# Altium project STM32F373BluePill.PrjPcb (part 1 of 4)
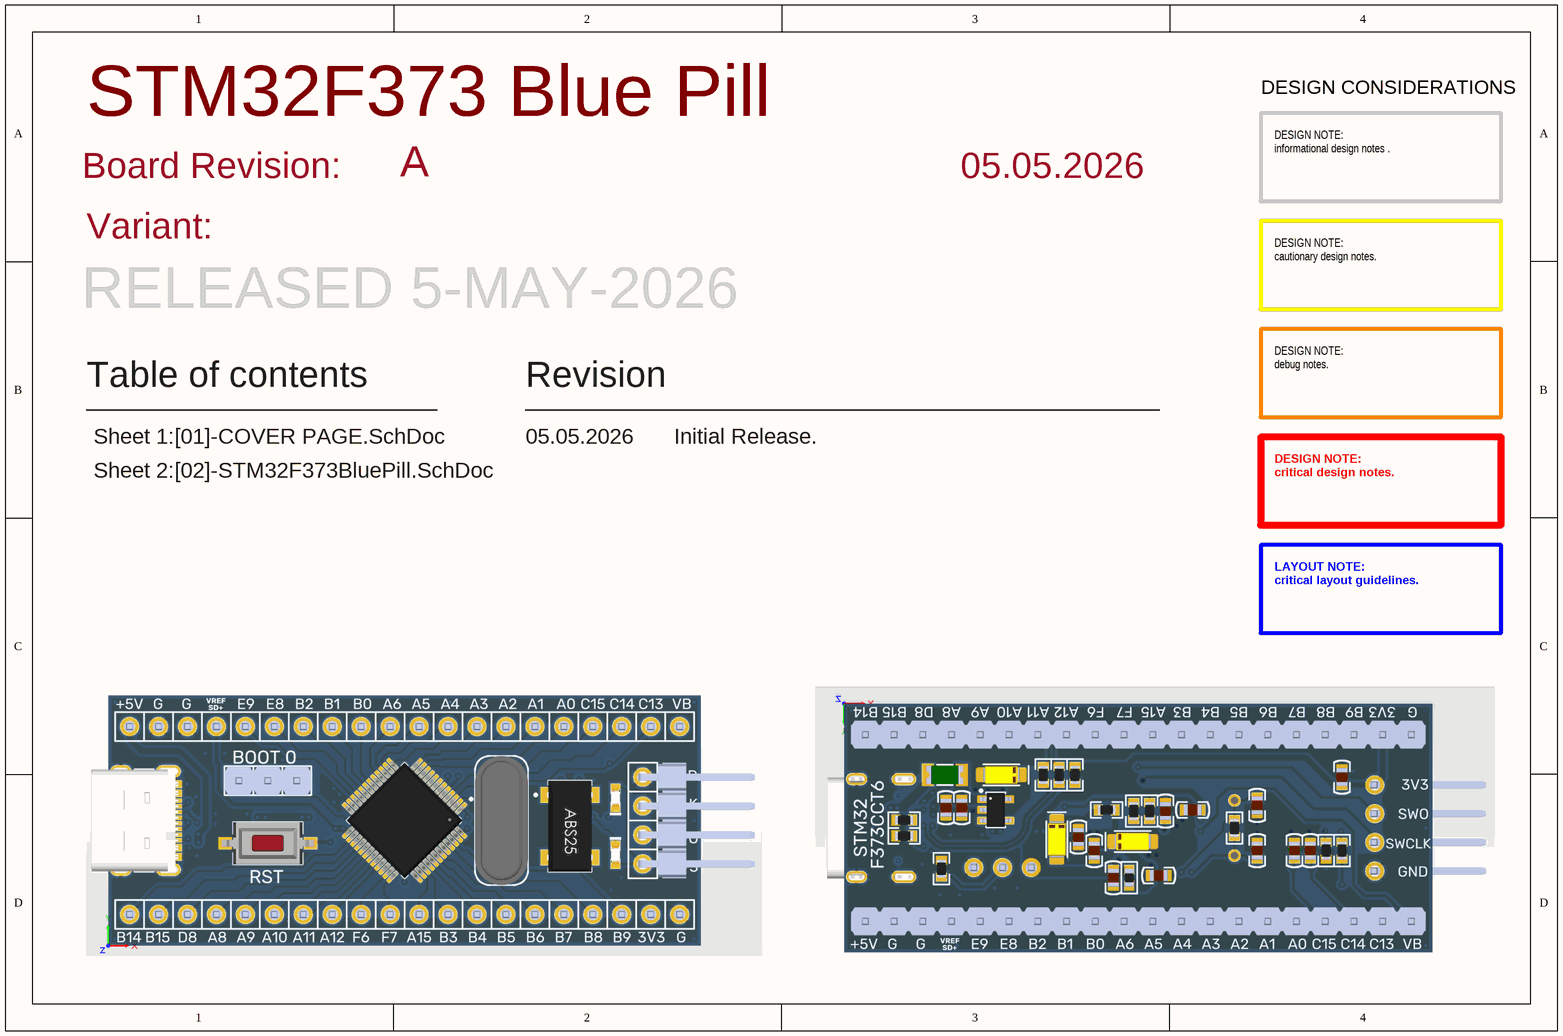
[diagram p0: [01]-COVER PAGE.SchDoc]
BoardName: STM32F373 Blue Pill; BoardRevision: A
2 sheets, 42 parts. Net scope: global (net labels, ports and power ports of the same name join across sheets).
Board file: STM32F373BluePill.PcbDoc
Sheets:
  [01]-COVER PAGE.SchDoc
  [02]-STM32F373BluePill.SchDoc

## Sheet [01]-COVER PAGE.SchDoc
size A4; Revision: 1.0; SheetNumber: 1; SheetTotal: 2

### Notes on the sheet
- DESIGN CONSIDERATIONS
- Variant:
- Board Revision:
- 05.05.2026
- DESIGN NOTE:
  informational design notes .
- DESIGN NOTE:
  cautionary design notes.
- RELEASED 5-MAY-2026
- Table of contents
- Sheet 1:
- Revision
- Initial Release.
- DESIGN NOTE:
  debug notes.
- Sheet 2:
- [02]-STM32F373BluePill.SchDoc
- DESIGN NOTE:
  critical design notes.
- LAYOUT NOTE:
  critical layout guidelines.

## Sheet [02]-STM32F373BluePill.SchDoc
size A4; Revision: A; SheetNumber: 2; SheetTotal: 2
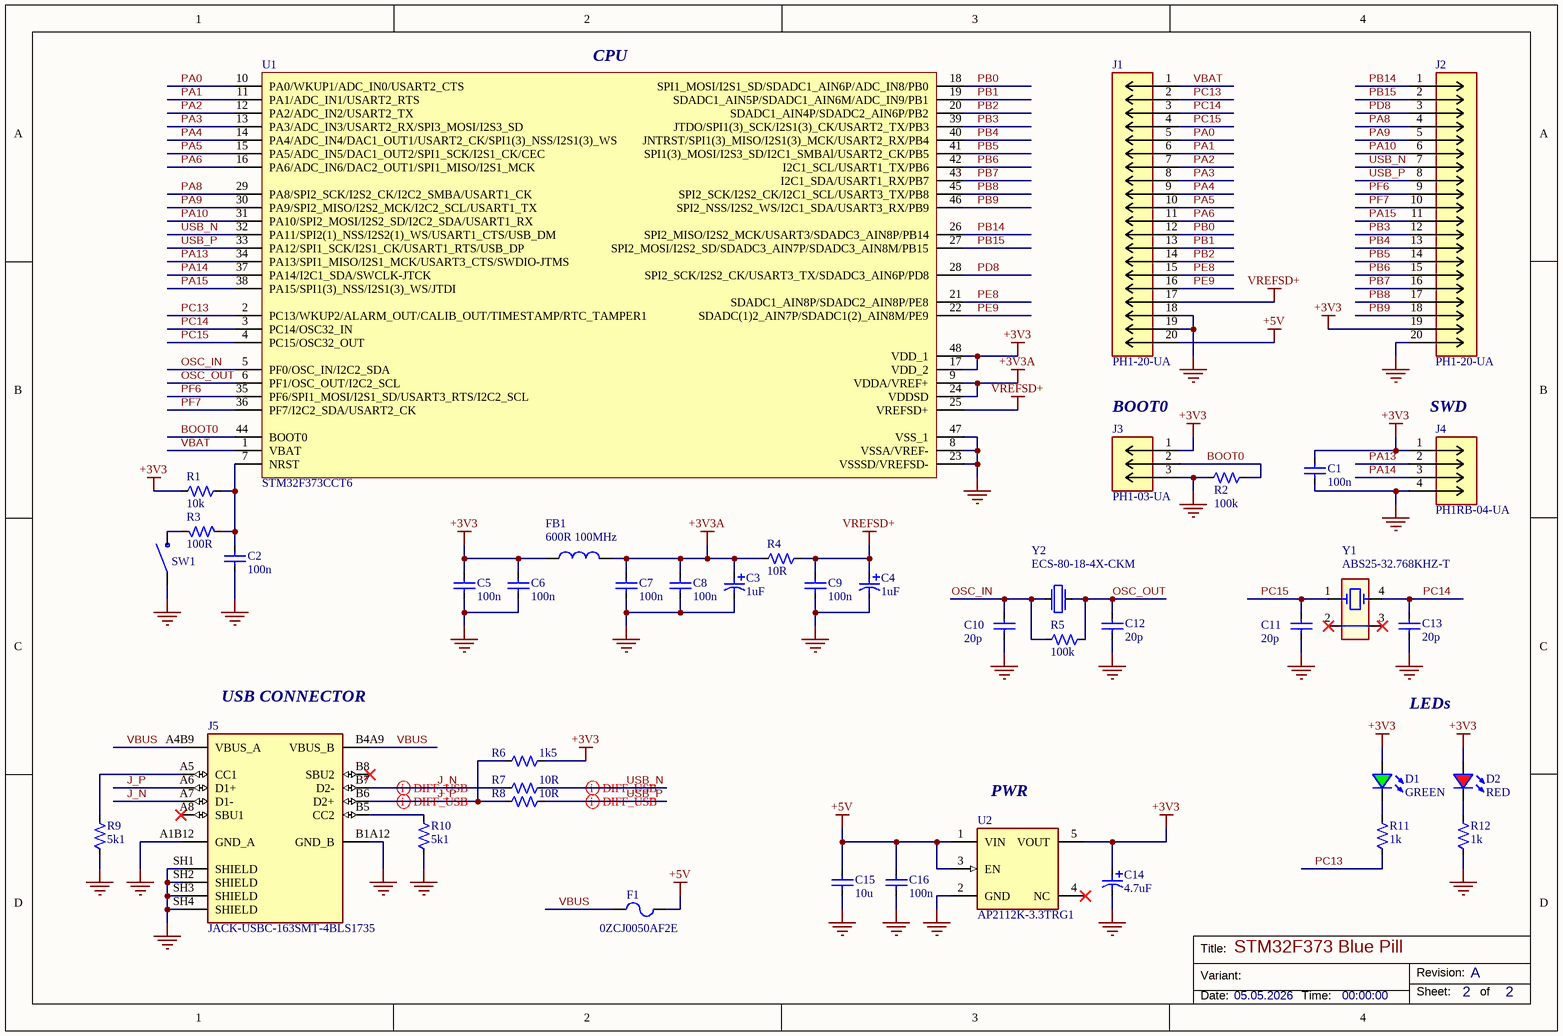
[diagram p1: [02]-STM32F373BluePill.SchDoc]

### Parts
C1  100n  [CAPC0603(1608Metric)L]
C2  100n  [CAPC0603(1608Metric)L]
C3  1uF  [CAPMP3216X180N]
C4  1uF  [CAPMP3216X180N]
C5  100n  [CAPC0603(1608Metric)L]
C6  100n  [CAPC0603(1608Metric)L]
C7  100n  [CAPC0603(1608Metric)L]
C8  100n  [CAPC0603(1608Metric)L]
C9  100n  [CAPC0603(1608Metric)L]
C10  20p  [CAPC0603(1608Metric)L]
C11  20p  [CAPC0603(1608Metric)L]
C12  20p  [CAPC0603(1608Metric)L]
C13  20p  [CAPC0603(1608Metric)L]
C14  4.7uF  [CAPMP3216X180N]
C15  10u  [CAPC0603(1608Metric)L]
C16  100n  [CAPC0603(1608Metric)L]
D1  GREEN  [WL-SMCW_0603_150060xx75003]
D2  RED  [WL-SMCW_0603_150060xx75003]
F1  0ZCJ0050AF2E  [0ZCJ_BEL]
FB1  600R 100MHz  [BEADC1608X95N]
J1  PH1-20-UA  [CONN_PH1-20-UA_ADM]
J2  PH1-20-UA  [CONN_PH1-20-UA_ADM]
J3  PH1-03-UA  [CONN_PH1-03-UA]
J4  PH1RB-04-UA  [CONN_PH1RB-04-UA]
J5  JACK-USBC-163SMT-4BLS1735  [JACK-USBC-163SMT-4BLS1735]
R1  10k  [RESC0603(1608Metric)L]
R2  100k  [RESC0603(1608Metric)L]
R3  100R  [RESC0603(1608Metric)L]
R4  10R  [RESC0603(1608Metric)L]
R5  100k  [RESC0603(1608Metric)L]
R6  1k5  [RESC0603(1608Metric)L]
R7  10R  [RESC0603(1608Metric)L]
R8  10R  [RESC0603(1608Metric)L]
R9  5k1  [RESC0603(1608Metric)L]
R10  5k1  [RESC0603(1608Metric)L]
R11  1k  [RESC0603(1608Metric)L]
R12  1k  [RESC0603(1608Metric)L]
SW1  TS09-63-25-R-260-SMT-TR  [SW_TS09-63-25-R-260-SMT-TR]  (value not drawn)
U1  STM32F373CCT6  [QFP50P900X900X160-48N]
U2  AP2112K-3.3TRG1  [SOT95P285X140-5N]
Y1  ABS25-32.768KHZ-T  [XTAL_ABS25-32.768KHZ-6-1-T]
Y2  ECS-80-18-4X-CKM  [XTAL_ECS-80-18-4X-CKM]

### Nets
+3V3: C1.2 C5.2 C6.2 C14.1 D1.1(POS) D2.1(POS) FB1.1 J2.19 J3.1 J4.1 R1.2 R6.1 U1.17(VDD_2) U1.48(VDD_1) U2.5(VOUT)
+3V3A: C3.1 C7.2 C8.2 FB1.2 R4.2 U1.9(VDDA/VREF+) U1.24(VDDSD)
+5V: C15.2 C16.2 F1.2 J1.20 U2.1(VIN) U2.3(EN)
GND: C1.1 C2.1 C3.2 C4.2 C5.1 C6.1 C7.1 C8.1 C9.1 C10.1 C11.1 C12.1 C13.1 C14.2 C15.1 C16.1 J1.18 J1.19 J2.20 J3.3 J4.4 J5.A1B12(GND_A) J5.B1A12(GND_B) J5.SH1(SHIELD) J5.SH2(SHIELD) J5.SH3(SHIELD) J5.SH4(SHIELD) R2.2 R9.2 R10.2 R12.2 SW1.1 U1.8(VSSA/VREF-) U1.23(VSSSD/VREFSD-) U1.47(VSS_1) U2.2(GND)
VREFSD+: C4.1 C9.2 J1.17 R4.1 U1.25(VREFSD+)
BOOT0: J3.2 R2.1 U1.44(BOOT0)
J_N: J5.A7(D1-) J5.B7(D2-) R7.2
J_P: J5.A6(D1+) J5.B6(D2+) R6.2 R8.2
OSC_IN: C10.2 R5.2 U1.5(PF0/OSC_IN/I2C2_SDA) Y2.1
OSC_OUT: C12.2 R5.1 U1.6(PF1/OSC_OUT/I2C2_SCL) Y2.2
PA0: J1.5 U1.10(PA0/WKUP1/ADC_IN0/USART2_CTS)
PA1: J1.6 U1.11(PA1/ADC_IN1/USART2_RTS)
PA2: J1.7 U1.12(PA2/ADC_IN2/USART2_TX)
PA3: J1.8 U1.13(PA3/ADC_IN3/USART2_RX/SPI3_MOSI/I2S3_SD)
PA4: J1.9 U1.14(PA4/ADC_IN4/DAC1_OUT1/USART2_CK/SPI1(3)_NSS/I2S1(3)_WS)
PA5: J1.10 U1.15(PA5/ADC_IN5/DAC1_OUT2/SPI1_SCK/I2S1_CK/CEC)
PA6: J1.11 U1.16(PA6/ADC_IN6/DAC2_OUT1/SPI1_MISO/I2S1_MCK)
PA8: J2.4 U1.29(PA8/SPI2_SCK/I2S2_CK/I2C2_SMBA/USART1_CK)
PA9: J2.5 U1.30(PA9/SPI2_MISO/I2S2_MCK/I2C2_SCL/USART1_TX)
PA10: J2.6 U1.31(PA10/SPI2_MOSI/I2S2_SD/I2C2_SDA/USART1_RX)
PA13: J4.2 U1.34(PA13/SPI1_MISO/I2S1_MCK/USART3_CTS/SWDIO-JTMS)
PA14: J4.3 U1.37(PA14/I2C1_SDA/SWCLK-JTCK)
PA15: J2.11 U1.38(PA15/SPI1(3)_NSS/I2S1(3)_WS/JTDI)
PB0: J1.12 U1.18(SPI1_MOSI/I2S1_SD/SDADC1_AIN6P/ADC_IN8/PB0)
PB1: J1.13 U1.19(SDADC1_AIN5P/SDADC1_AIN6M/ADC_IN9/PB1)
PB2: J1.14 U1.20(SDADC1_AIN4P/SDADC2_AIN6P/PB2)
PB3: J2.12 U1.39(JTDO/SPI1(3)_SCK/I2S1(3)_CK/USART2_TX/PB3)
PB4: J2.13 U1.40(JNTRST/SPI1(3)_MISO/I2S1(3)_MCK/USART2_RX/PB4)
PB5: J2.14 U1.41(SPI1(3)_MOSI/I2S3_SD/I2C1_SMBAl/USART2_CK/PB5)
PB6: J2.15 U1.42(I2C1_SCL/USART1_TX/PB6)
PB7: J2.16 U1.43(I2C1_SDA/USART1_RX/PB7)
PB8: J2.17 U1.45(SPI2_SCK/I2S2_CK/I2C1_SCL/USART3_TX/PB8)
PB9: J2.18 U1.46(SPI2_NSS/I2S2_WS/I2C1_SDA/USART3_RX/PB9)
PB14: J2.1 U1.26(SPI2_MISO/I2S2_MCK/USART3/SDADC3_AIN8P/PB14)
PB15: J2.2 U1.27(SPI2_MOSI/I2S2_SD/SDADC3_AIN7P/SDADC3_AIN8M/PB15)
PC13: J1.2 R11.2 U1.2(PC13/WKUP2/ALARM_OUT/CALIB_OUT/TIMESTAMP/RTC_TAMPER1)
PC14: C13.2 J1.3 U1.3(PC14/OSC32_IN) Y1.4
PC15: C11.2 J1.4 U1.4(PC15/OSC32_OUT) Y1.1
PD8: J2.3 U1.28(SPI2_SCK/I2S2_CK/USART3_TX/SDADC3_AIN6P/PD8)
PE8: J1.15 U1.21(SDADC1_AIN8P/SDADC2_AIN8P/PE8)
PE9: J1.16 U1.22(SDADC(1)2_AIN7P/SDADC1(2)_AIN8M/PE9)
PF6: J2.9 U1.35(PF6/SPI1_MOSI/I2S1_SD/USART3_RTS/I2C2_SCL)
PF7: J2.10 U1.36(PF7/I2C2_SDA/USART2_CK)
USB_N: J2.7 R7.1 U1.32(PA11/SPI2(1)_NSS/I2S2(1)_WS/USART1_CTS/USB_DM)
USB_P: J2.8 R8.1 U1.33(PA12/SPI1_SCK/I2S1_CK/USART1_RTS/USB_DP)
VBAT: J1.1 U1.1(VBAT)
VBUS: F1.1 J5.A4B9(VBUS_A) J5.B4A9(VBUS_B)
NetC2_2: C2.2 R1.1 R3.2 U1.7(NRST)
NetD1_2: D1.2(NEG) R11.1
NetD2_2: D2.2(NEG) R12.1
NetJ5_A5: J5.A5(CC1) R9.1
NetJ5_B5: J5.B5(CC2) R10.1
NetR3_1: R3.1 SW1.2

Not connected (* = marked no-connect by the designer): J5 A8(SBU1)* B8(SBU2)*; U2 4(NC)*; Y1 2* 3*

### Layout directives
differential pair; differential pair class USB: J_N, J_P, USB_N
differential pair; differential pair class DIFF_USB: USB_P

### Notes on the sheet
- (near U1) CPU
- (near J3) BOOT0
- (near J4) SWD
- (near J5) USB CONNECTOR
- LEDs
- (near U2) PWR
- Title:
- Variant:
- Revision:
- Date:
- 05.05.2026
- Time:
- 00:00:00
- Sheet:
- of